# EAGLE design base_board4 (EAGLE 7.7.0)
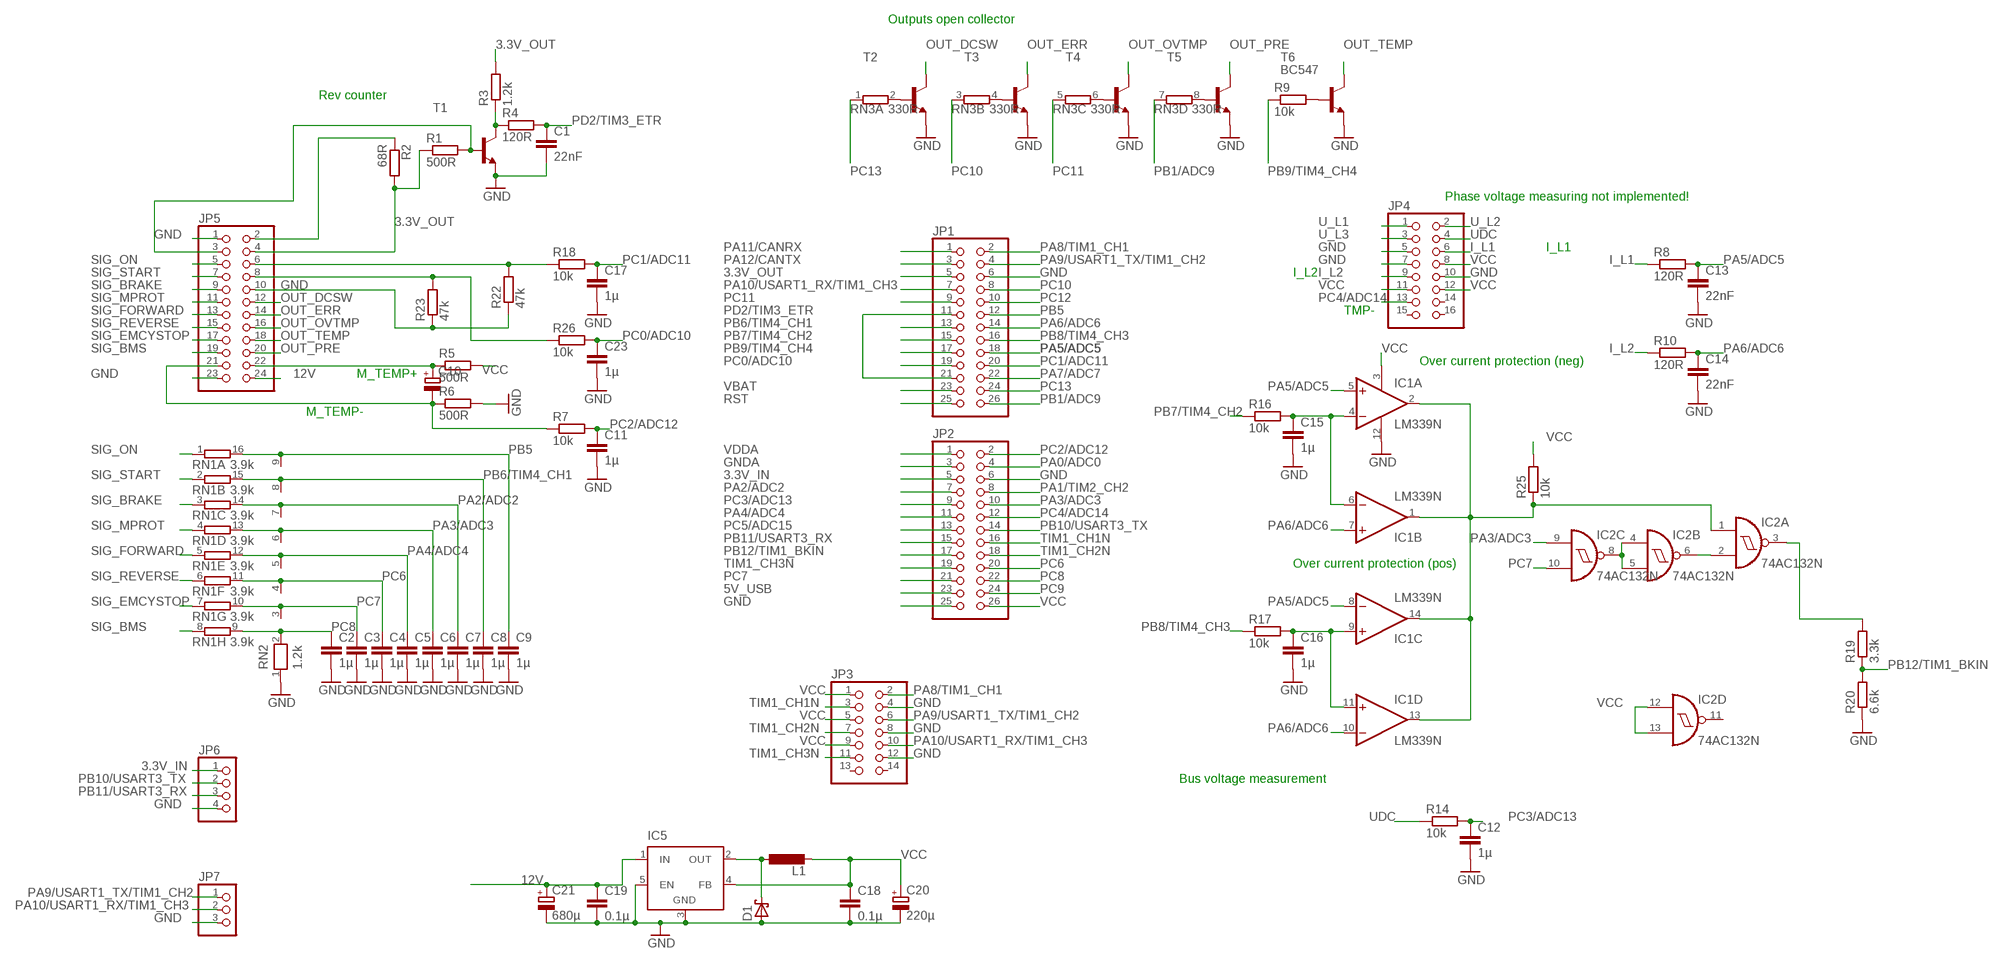
[diagram p0: schematic, sheet 1]

## Parts
C1  22nF  C-EU025-024X044  [C025-024X044]
C2  1µ  C-EU025-024X044  [C025-024X044]
C3  1µ  C-EU025-024X044  [C025-024X044]
C4  1µ  C-EU025-024X044  [C025-024X044]
C5  1µ  C-EU025-024X044  [C025-024X044]
C6  1µ  C-EU025-024X044  [C025-024X044]
C7  1µ  C-EU025-024X044  [C025-024X044]
C8  1µ  C-EU025-024X044  [C025-024X044]
C9  1µ  C-EU025-024X044  [C025-024X044]
C10  CPOL-EUE2-4  [E2-4]
C11  1µ  C-EU025-024X044  [C025-024X044]
C12  1µ  C-EU025-024X044  [C025-024X044]
C13  22nF  C-EU025-024X044  [C025-024X044]
C14  22nF  C-EU025-024X044  [C025-024X044]
C15  1µ  C-EU025-024X044  [C025-024X044]
C16  1µ  C-EU025-024X044  [C025-024X044]
C17  1µ  C-EU025-024X044  [C025-024X044]
C18  0.1µ  C-EU050-024X044  [C050-024X044]
C19  0.1µ  C-EU050-024X044  [C050-024X044]
C20  220µ  CPOL-EUE2-4  [E2-4]
C21  680µ  CPOL-EUE2.5-5  [E2,5-5]
C23  1µ  C-EU025-024X044  [C025-024X044]
D1  SCHOTTKY-DIODEDO201T15  [DO201T15]
IC1  LM339N  [DIL14]
IC2  74AC132N  [DIL14]
IC5  LM2596TV  [TO220-51]
JP1  PINHD-2X13  [2X13]
JP2  PINHD-2X13  [2X13]
JP3  PINHD-2X7  [2X07]
JP4  PINHD-2X8  [2X08]
JP5  PINHD-2X12  [2X12]
JP6  PINHD-1X4  [1X04]
JP7  PINHD-1X3  [1X03]
L1  L-EUTJ3-U1  [TJ3-U1]
R1  500R  R-EU_0207/10  [0207/10]
R2  68R  R-EU_0207/10  [0207/10]
R3  1.2k  R-EU_0207/10  [0207/10]
R4  120R  R-EU_0207/10  [0207/10]
R5  500R  R-EU_0207/10  [0207/10]
R6  500R  R-EU_0207/10  [0207/10]
R7  10k  R-EU_0207/10  [0207/10]
R8  120R  R-EU_0207/10  [0207/10]
R9  10k  R-EU_0207/10  [0207/10]
R10  120R  R-EU_0207/10  [0207/10]
R14  10k  R-EU_0207/10  [0207/10]
R16  10k  R-EU_0207/10  [0207/10]
R17  10k  R-EU_0207/10  [0207/10]
R18  10k  R-EU_0207/10  [0207/10]
R19  3.3k  R-EU_0207/10  [0207/10]
R20  6.6k  R-EU_0207/10  [0207/10]
R22  47k  R-EU_0207/10  [0207/10]
R23  47k  R-EU_0207/10  [0207/10]
R25  10k  R-EU_0207/10  [0207/10]
R26  10k  R-EU_0207/10  [0207/10]
RN1  3.9k  8R-N  [DIL16]
RN2  1.2k  RN08  [RN-9]
RN3  330R  E4R  [SIL8]
T1  BC547B-NPN-TO92-EBC  [TO92-EBC]
T2  -NPN-TO92-EBC  [TO92-EBC]
T3  -NPN-TO92-EBC  [TO92-EBC]
T4  -NPN-TO92-EBC  [TO92-EBC]
T5  -NPN-TO92-EBC  [TO92-EBC]
T6  BC547  [TO92]

## Nets
3.3V_IN: JP2.5 JP6.1
3.3V_OUT: JP1.5 JP5.4 R1.1 R2.2 R3.2
5V_USB: JP2.23
12V: C19.1 C21.+ IC5.1(IN) JP5.24
GND: C1.2 C2.2 C3.2 C4.2 C5.2 C6.2 C7.2 C8.2 C9.2 C11.2 C12.2 C13.2 C14.2 C15.2 C16.2 C17.2 C18.2 C19.2 C20.- C21.- C23.2 D1.A IC1.12(P:GND) IC5.3(GND) IC5.5(EN) JP1.6 JP2.6 JP2.25 JP3.4 JP3.8 JP3.12 JP4.5 JP4.7 JP4.10 JP5.1 JP5.10 JP5.23 JP6.4 JP7.3 R6.2 R20.1 R22.1 R23.1 RN2.1 T1.E T2.E T3.E T4.E T5.E T6.1(E)
GNDA: JP2.3
I_L1: JP4.6 R8.1
I_L2: JP4.9 R10.1
N2: R3.1 R4.1 T1.C
N$1: RN3.2 T2.B
N$2: RN3.4 T3.B
N$3: JP5.2 R2.1
N$4: RN3.6 T4.B
N$5: JP5.3 R1.2 T1.B
N$6: RN3.8 T5.B
N$7: R9.2 T6.2(B)
N$9: IC2.3(A:O) R19.2
N$10: C16.1 IC1.9(C:+IN) IC1.11(D:+IN) R17.2
N$12: IC2.2(A:I1) IC2.6(B:O)
N$13: C10.+ JP5.22 R5.1
N$14: D1.C IC5.2(OUT) L1.1
N$15: C15.1 IC1.4(A:-IN) IC1.6(B:-IN) R16.2
N$16: C10.- JP5.21 R6.1 R7.1
N$17: IC2.4(B:I0) IC2.5(B:I1) IC2.8(C:O)
N$21: IC1.1(B:OUT) IC1.2(A:OUT) IC1.13(D:OUT) IC1.14(C:OUT) IC2.1(A:I0) R25.1
OUT_DCSW: JP5.12 T2.C
OUT_ERR: JP5.14 T3.C
OUT_OVTMP: JP5.16 T4.C
OUT_PRE: JP5.20 T5.C
OUT_TEMP: JP5.18 T6.3(C)
PA0/ADC0: JP2.4
PA1/TIM2_CH2: JP2.8
PA2/ADC2: C7.1 JP2.7 RN1.14 RN2.7
PA3/ADC3: C6.1 IC2.9(C:I0) JP2.10 RN1.13 RN2.6
PA4/ADC4: C5.1 JP2.11 RN1.12 RN2.5
PA5/ADC5: C13.1 IC1.5(A:+IN) IC1.8(C:-IN) JP1.18 R8.2
PA6/ADC6: C14.1 IC1.7(B:+IN) IC1.10(D:-IN) JP1.14 R10.2
PA7/ADC7: JP1.22
PA8/TIM1_CH1: JP1.2 JP3.2
PA9/USART1_TX/TIM1_CH2: JP1.4 JP3.6 JP7.1
PA10/USART1_RX/TIM1_CH3: JP1.7 JP3.10 JP7.2
PA11/CANRX: JP1.1
PA12/CANTX: JP1.3
PB1/ADC9: JP1.26 RN3.7
PB5: C9.1 JP1.12 RN1.16 RN2.9
PB6/TIM4_CH1: C8.1 JP1.13 RN1.15 RN2.8
PB7/TIM4_CH2: JP1.15 R16.1
PB8/TIM4_CH3: JP1.16 R17.1
PB9/TIM4_CH4: JP1.17 R9.1
PB10/USART3_TX: JP2.14 JP6.2
PB11/USART3_RX: JP2.15 JP6.3
PB12/TIM1_BKIN: JP2.17 R19.1 R20.2
PC0/ADC10: C23.1 JP1.19 R26.2
PC1/ADC11: C17.1 JP1.20 R18.2
PC2/ADC12: C11.1 JP2.2 R7.2
PC3/ADC13: C12.1 JP2.9 R14.2
PC4/ADC14: JP2.12 JP4.13
PC5/ADC15: JP2.13
PC6: C4.1 JP2.20 RN1.11 RN2.4
PC7: C3.1 IC2.10(C:I1) JP2.21 RN1.10 RN2.3
PC8: C2.1 JP2.22 RN1.9 RN2.2
PC9: JP2.24
PC10: JP1.8 RN3.3
PC11: JP1.9 RN3.5
PC12: JP1.10
PC13: JP1.24 RN3.1
PD2/TIM3_ETR: C1.1 JP1.11 JP1.21 R4.2
RST: JP1.25
SIG_BMS: JP5.19 RN1.8
SIG_BRAKE: JP5.9 RN1.3
SIG_EMCYSTOP: JP5.17 RN1.7
SIG_FORWARD: JP5.13 RN1.5
SIG_MPROT: JP5.11 RN1.4
SIG_ON: JP5.5 RN1.1
SIG_REVERSE: JP5.15 RN1.6
SIG_START: JP5.7 RN1.2
TIM1_CH1N: JP2.16 JP3.3
TIM1_CH2N: JP2.18 JP3.7
TIM1_CH3N: JP2.19 JP3.11
U_L1: JP4.1
U_L2: JP4.2
U_L3: JP4.3
UDC: JP4.4 R14.1
VBAT: JP1.23
VCC: C18.1 C20.+ IC1.3(P:V+) IC2.12(D:I0) IC2.13(D:I1) IC5.4(FB) JP2.26 JP3.1 JP3.5 JP3.9 JP4.8 JP4.11 JP4.12 L1.2 R5.2 R25.2
VDDA: JP2.1
X: JP5.6 R18.1 R22.2
Y: JP5.8 R23.2 R26.1
Unconnected: IC2.11(D:O) JP3.13 JP3.14 JP4.14 JP4.15 JP4.16

## Notes on the sheet
- Outputs open collector
- Rev counter
- Phase voltage measuring not implemented!
- I_L1
- I_L2
- TMP-
- Over current protection (neg)
- M_TEMP+
- M_TEMP-
- Over current protection (pos)
- Bus voltage measurement

## Power pins joined to a net without a drawn wire
GND: IC2.7(P:GND)
VCC: IC2.14(P:VCC)

## Library data of the parts
C1-C9 C11-C19 C23 = rcl:C-EU: CAPACITOR, European symbol
C10 C20 C21 = rcl:CPOL-EU: POLARIZED CAPACITOR, European symbol
D1 = diode:SCHOTTKY-DIODE: Schottky Diode
IC1 = linear:LM339: Low Power Low Offset Voltage Quad Comparators with open collector; LM139/LM239/LM339/LM2901/LM3302
IC2 = 74xx-eu:74*132: Quad 2-input NAND schmitt trigger
IC5 = linear:LM2596T: STEP-DOWN VOLTAGE REGULATOR
JP1 JP2 = pinhead:PINHD-2X13: PIN HEADER
JP3 = pinhead:PINHD-2X7: PIN HEADER
JP4 = pinhead:PINHD-2X8: PIN HEADER
JP5 = pinhead:PINHD-2X12: PIN HEADER
JP6 = pinhead:PINHD-1X4: PIN HEADER
JP7 = pinhead:PINHD-1X3: PIN HEADER
L1 = rcl:L-EU: INDUCTOR, European symbol
R1-R10 R14 R16-R20 R22 R23 R25 R26 = rcl:R-EU_: RESISTOR, European symbol
RN1 = resistor-dil:8R-N: DIL RESISTOR
RN2 = resistor-net:RN08: RESISTOR NETWORK
RN3 = resistor-sil:E4R: SIL RESISTOR
T1 = transistor:*-NPN-: NPN Transistror BF959 corrected 2008.03.06
T2-T5 = transistor-neu-to92:*-NPN-: NPN Transistror BF959 corrected 2008.03.06
T6 = transistor:BC547: NPN TRANSISTOR

## Board
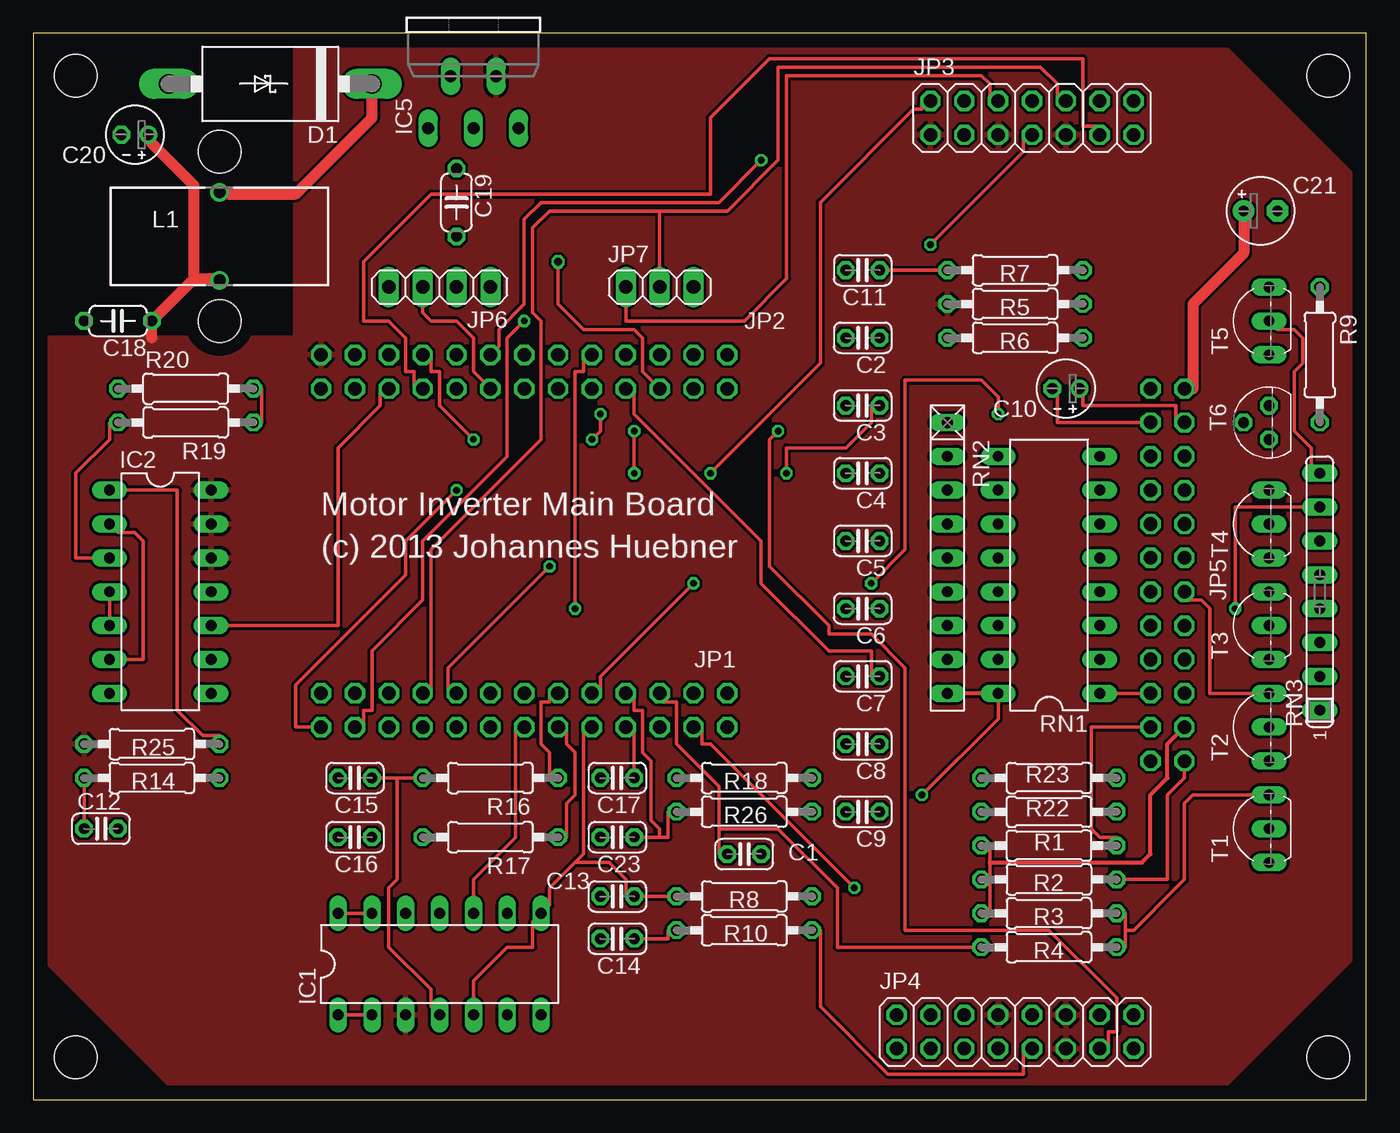
[diagram p1: board, top side]
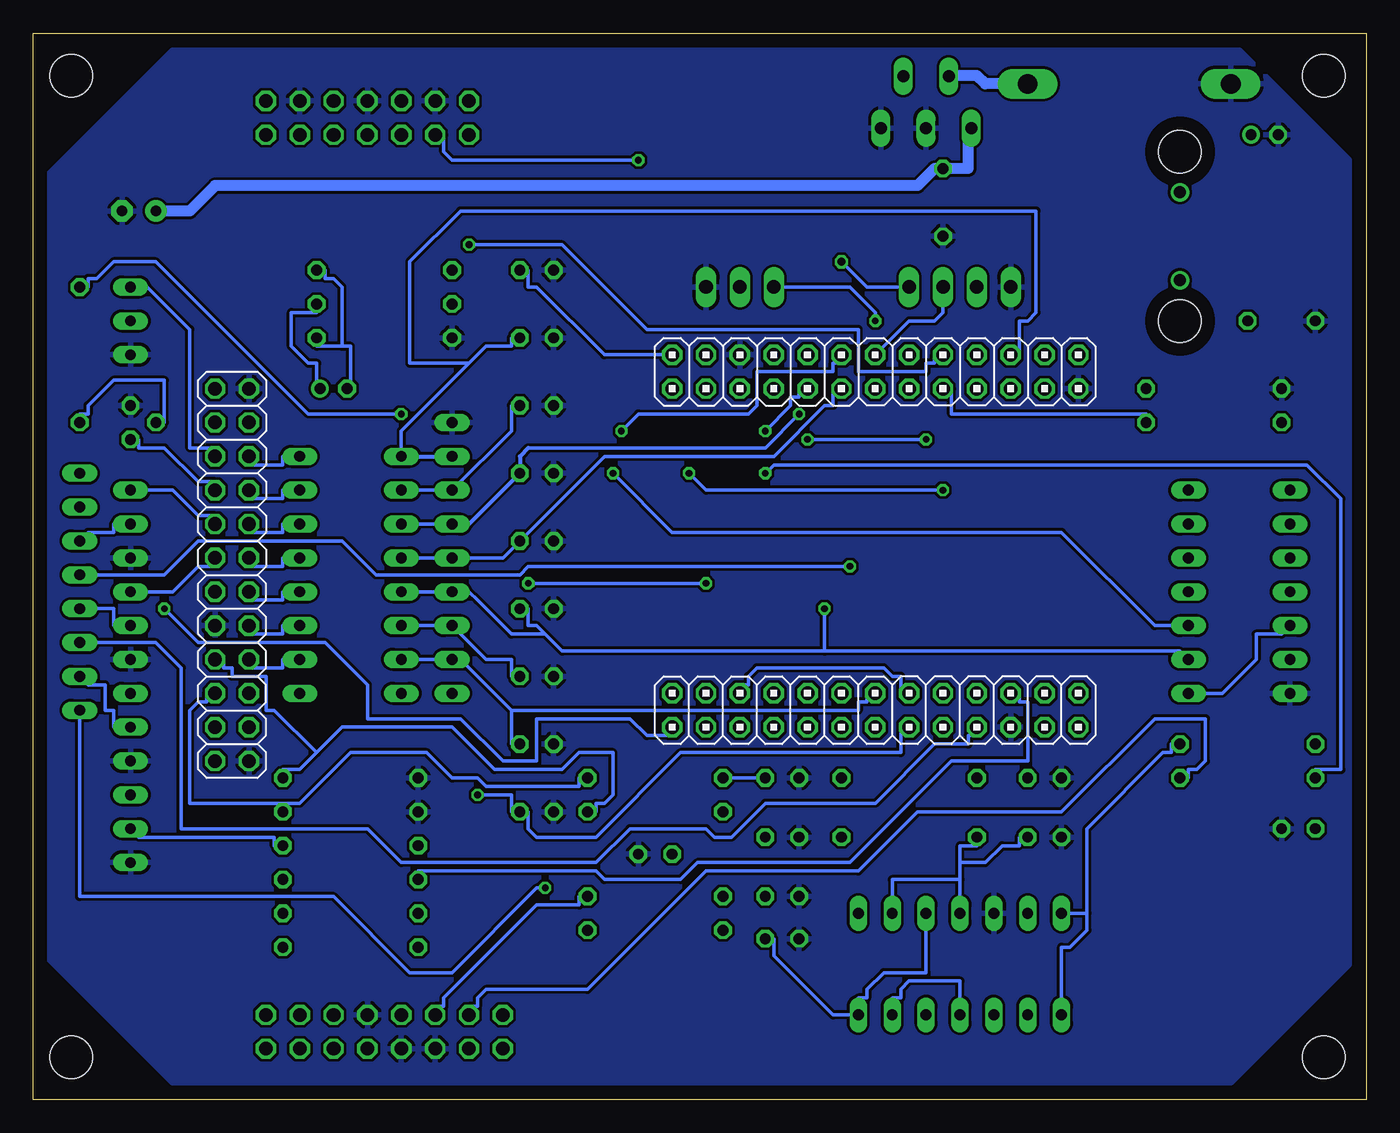
[diagram p2: board, bottom side, seen from below]

Size 100 x 80 mm. Coordinates in mm from the lower left corner, seen from the top.
Outline: 0,0 100,0 100,80 0,80 0,0
Copper layers (1*16): Top 0.035mm / dielectric 1.5mm / Bottom 0.035mm
Design rules "default *": minimum track width 10mil, minimum drill 20mil, track to track 8mil, track to pad 8mil, pad to pad 8mil, via to via 8mil, smd to smd 8mil, copper to edge 40mil, drill to drill 8mil, minimum pad ring 10mil, minimum via ring 8mil, stop-mask expansion 4mil, vias tented up to drill 0mil, thermal gap 10mil
Holes 3.2 mm at 3.17,76.83 3.17,3.17 97.16,3.17 97.16,76.83 13.97,71.12 13.97,58.42

### Footprints (pad centres in the part's own frame; a part is rotated, then mirrored left to right if it is on the bottom)
C025-024X044 = drill 0.813 octagon: 1 -1.27,0; 2 1.27,0
E2-4 = drill 0.813 pad 1.27: + -1.016,0 | drill 0.813 pad 1.27 octagon: - 1.016,0
C050-024X044 = drill 0.813 octagon: 1 -2.54,0; 2 2.54,0
E2,5-5 = drill 0.813 pad 1.6: + -1.27,0 | drill 0.813 pad 1.6 octagon: - 1.27,0
DO201T15 = drill 1.499 long: A 7.62,0; C -7.62,0
DIL14 = drill 0.813 long: 1 -7.62,-3.81; 2 -5.08,-3.81; 3 -2.54,-3.81; 4 0,-3.81; 5 2.54,-3.81; 6 5.08,-3.81; 7 7.62,-3.81; 8 7.62,3.81; 9 5.08,3.81; 10 2.54,3.81; 11 0,3.81; 12 -2.54,3.81; 13 -5.08,3.81; 14 -7.62,3.81
TO220-51 = drill 0.9 long: 1 -3.4,-8.4; 2 -1.7,-4.5; 3 0,-8.4; 4 1.7,-4.5; 5 3.4,-8.4
2X13 = drill 1.016 octagon: 1 -15.24,-1.27; 2 -15.24,1.27; 3 -12.7,-1.27; 4 -12.7,1.27; 5 -10.16,-1.27; 6 -10.16,1.27; 7 -7.62,-1.27; 8 -7.62,1.27; 9 -5.08,-1.27; 10 -5.08,1.27; 11 -2.54,-1.27; 12 -2.54,1.27; 13 0,-1.27; 14 0,1.27; 15 2.54,-1.27; 16 2.54,1.27; 17 5.08,-1.27; 18 5.08,1.27; 19 7.62,-1.27; 20 7.62,1.27; 21 10.16,-1.27; 22 10.16,1.27; 23 12.7,-1.27; 24 12.7,1.27; 25 15.24,-1.27; 26 15.24,1.27
2X07 = drill 1.016 octagon: 1 -7.62,-1.27; 2 -7.62,1.27; 3 -5.08,-1.27; 4 -5.08,1.27; 5 -2.54,-1.27; 6 -2.54,1.27; 7 0,-1.27; 8 0,1.27; 9 2.54,-1.27; 10 2.54,1.27; 11 5.08,-1.27; 12 5.08,1.27; 13 7.62,-1.27; 14 7.62,1.27
2X08 = drill 1.016 octagon: 1 -8.89,-1.27; 2 -8.89,1.27; 3 -6.35,-1.27; 4 -6.35,1.27; 5 -3.81,-1.27; 6 -3.81,1.27; 7 -1.27,-1.27; 8 -1.27,1.27; 9 1.27,-1.27; 10 1.27,1.27; 11 3.81,-1.27; 12 3.81,1.27; 13 6.35,-1.27; 14 6.35,1.27; 15 8.89,-1.27; 16 8.89,1.27
2X12 = drill 1.016 octagon: 1 -13.97,-1.27; 2 -13.97,1.27; 3 -11.43,-1.27; 4 -11.43,1.27; 5 -8.89,-1.27; 6 -8.89,1.27; 7 -6.35,-1.27; 8 -6.35,1.27; 9 -3.81,-1.27; 10 -3.81,1.27; 11 -1.27,-1.27; 12 -1.27,1.27; 13 1.27,-1.27; 14 1.27,1.27; 15 3.81,-1.27; 16 3.81,1.27; 17 6.35,-1.27; 18 6.35,1.27; 19 8.89,-1.27; 20 8.89,1.27; 21 11.43,-1.27; 22 11.43,1.27; 23 13.97,-1.27; 24 13.97,1.27
1X04 = drill 1.016 long: 1 -3.81,0; 2 -1.27,0; 3 1.27,0; 4 3.81,0
1X03 = drill 1.016 long: 1 -2.54,0; 2 0,0; 3 2.54,0
TJ3-U1 = drill 0.9: 1 -3.3,0; 2 3.3,0
0207/10 = drill 0.813 octagon: 1 -5.08,0; 2 5.08,0
DIL16 = drill 0.813 long: 1 -8.89,-3.81; 2 -6.35,-3.81; 3 -3.81,-3.81; 4 -1.27,-3.81; 5 1.27,-3.81; 6 3.81,-3.81; 7 6.35,-3.81; 8 8.89,-3.81; 9 8.89,3.81; 10 6.35,3.81; 11 3.81,3.81; 12 1.27,3.81; 13 -1.27,3.81; 14 -3.81,3.81; 15 -6.35,3.81; 16 -8.89,3.81
RN-9 = drill 0.813 long: 1 -10.16,0; 2 -7.62,0; 3 -5.08,0; 4 -2.54,0; 5 0,0; 6 2.54,0; 7 5.08,0; 8 7.62,0; 9 10.16,0
SIL8 = drill 0.813 long: 1 -8.89,0; 2 -6.35,0; 3 -3.81,0; 4 -1.27,0; 5 1.27,0; 6 3.81,0; 7 6.35,0; 8 8.89,0
TO92-EBC = drill 0.813 long: B 0,-1.27; C 2.54,-1.27; E -2.54,-1.27
TO92 = drill 0.813 octagon: 1 1.27,0; 2 0,1.905; 3 -1.27,0

### Placement (x,y rotation side)
C1  53.34,18.41 0 top
C2  62.23,57.15 180 top
C3  62.23,52.07 180 top
C4  62.23,46.99 180 top
C5  62.23,41.91 180 top
C6  62.23,36.83 180 top
C7  62.23,31.75 180 top
C8  62.23,26.67 180 top
C9  62.23,21.59 180 top
C10  77.47,53.34 180 top
C11  62.23,62.23 180 top
C12  5.08,20.32 0 top
C13  43.81,15.24 180 top
C14  43.81,12.06 180 top
C15  24.13,24.13 180 top
C16  24.13,19.68 180 top
C17  43.81,24.13 180 top
C18  6.35,58.42 180 top
C19  31.75,67.31 270 top
C20  7.62,72.39 180 top
C21  92.08,66.67 0 top
C23  43.81,19.68 180 top
D1  17.78,76.2 180 top
IC1  30.48,10.16 0 top
IC2  9.53,38.1 270 top
IC5  33.02,81.28 0 top
JP1  36.83,29.21 180 bottom
JP2  36.83,54.61 0 bottom
JP3  74.93,73.66 0 top
JP4  73.66,5.08 0 top
JP5  85.09,39.37 90 bottom
JP6  30.48,60.96 180 top
JP7  46.99,60.96 0 top
L1  13.97,64.77 270 top
R1  76.2,19.05 0 top
R2  76.2,16.51 180 top
R3  76.2,13.97 180 top
R4  76.2,11.43 180 top
R5  73.66,59.69 180 top
R6  73.66,57.15 180 top
R7  73.66,62.23 180 top
R8  53.34,15.24 180 top
R9  96.52,55.88 270 top
R10  53.34,12.7 180 top
R14  8.89,24.13 180 top
R16  34.29,24.13 180 top
R17  34.29,19.68 180 top
R18  53.34,24.13 180 top
R19  11.43,50.8 180 top
R20  11.43,53.34 0 top
R22  76.2,21.59 0 top
R23  76.2,24.13 0 top
R25  8.89,26.67 180 top
R26  53.34,21.59 180 top
RN1  76.2,39.37 90 top
RN2  68.58,40.64 270 top
RN3  96.52,38.1 90 top
T1  91.44,20.32 90 top
T2  91.44,27.94 90 top
T3  91.44,35.56 90 top
T4  91.44,43.18 90 top
T5  91.44,58.42 90 top
T6  92.71,50.8 90 top

### Tracks (layer width: path | path; a pad name or v marks a point on that pad's centre or on a via)
3.3V_IN  (via drill 0.6)
  Top 0.254: JP2.5 45.72,54.61 45.72,57.15 45.09,57.78 41.27,57.78 39.37,59.69 v39.37,62.87
  Bottom 0.254: v39.37,62.87 37.47,60.96 JP6.1
3.3V_OUT
  Top 0.254: 71.75,16.51 71.75,13.97 R3.2 | 71.75,16.51 71.75,17.78 71.75,19.05 R1.1 | R2.2 71.75,16.51
  Top 0.305: JP5.4 85.09,26.67 85.09,24.13 83.82,22.86 83.82,18.41 83.19,17.78 71.75,17.78
  Bottom 0.254: JP1.5 26.04,30.48 26.04,29.84 25.4,29.84 25.4,25.4 31.11,25.4 38.73,17.78 50.16,17.78 51.44,16.51 57.15,16.51 57.78,17.14 71.12,17.14 R2.2
12V
  Top 0.254: 87,53.34 JP5.24
  Top 0.813: 87,53.34 87,59.69 90.81,63.5 C21.+
  Bottom 0.254: 29.84,73.03 IC5.1 | C19.1 32.38,69.85
  Bottom 0.813: 29.84,73.03 29.84,69.85 C19.1 | 32.38,69.85 33.66,68.58 86.36,68.58 88.27,66.67 C21.+
GND
  pour Bottom: 1.27,70.48 9.53,78.74 88.27,78.74 89.53,78.74 99.06,69.22 99.06,10.79 89.53,1.27 10.16,1.27 1.27,10.16
I_L1
  Bottom 0.254: R8.1 59.05,15.24 59.05,14.61 62.23,14.61 69.22,7.62 69.22,6.99 69.85,6.99 JP4.6
I_L2
  Top 0.254: R10.1 59.05,12.7 59.05,6.99 64.14,1.91 74.3,1.91 74.3,3.81 JP4.9
N2
  Top 0.254: 81.92,12.7 81.92,13.97 R3.1 | 81.92,12.7 81.92,11.43 R4.1 | 81.92,12.7 82.55,12.7 85.72,15.88 86.36,16.51 86.36,22.23 87,22.86 T1.C
N$1
  Bottom 0.254: T2.B 93.98,27.94 93.98,29.21 94.61,29.21 94.61,31.11 95.89,31.11 RN3.2
N$2
  Bottom 0.254: T3.B 93.98,35.56 93.98,36.83 RN3.4
N$3
  Top 0.254: JP5.2 86.36,24.13 85.09,22.86 85.09,16.51 R2.1
N$4
  Bottom 0.254: T4.B 93.98,43.18 93.98,42.55 95.89,42.55 RN3.6
N$5
  Top 0.254: JP5.3 79.38,27.94 79.38,20.32 80.01,19.68 81.28,19.68 R1.2
  Bottom 0.254: R1.2 81.92,19.05 81.92,19.68 92.08,19.68 T1.B
N$6
  Top 0.254: RN3.8 95.89,47.62 95.89,48.9 94.61,50.16 94.61,54.61 95.25,55.24 95.25,57.15 94.61,57.78 93.34,57.78 T5.B
N$7
  Bottom 0.254: T6.2 90.17,50.8 90.17,53.98 93.98,53.98 95.89,52.07 95.89,51.44 96.52,51.44 R9.2
N$9
  Top 0.254: IC2.3 3.17,40.64 3.17,46.99 5.71,49.53 5.71,50.8 R19.2
N$10
  Bottom 0.254: 30.48,17.78 30.48,19.05 29.21,19.05 R17.2 | 30.48,16.51 30.48,17.78 | IC1.11 30.48,16.51 | 30.48,16.51 35.56,16.51 IC1.9 | 30.48,17.78 28.57,17.78 27.3,19.05 26.04,19.05 26.04,19.68 C16.1
N$12
  Top 0.254: IC2.6 8.26,33.02 8.26,41.91 7.62,42.55 6.35,42.55 IC2.2
N$13
  Top 0.254: JP5.22 85.72,50.8 85.72,52.07 78.74,52.07 78.74,52.7 C10.+
  Bottom 0.254: C10.+ 78.74,53.98 78.74,55.24 79.38,55.24 80.64,56.52 80.64,59.05 78.74,59.05 R5.1
N$14
  Top 0.254: L1.1 14.61,67.94
  Top 0.813: 14.61,67.94 19.68,67.94 25.4,73.66 D1.C
  Bottom 0.254: 31.11,76.83 IC5.2
  Bottom 0.813: 31.11,76.83 29.21,76.83 28.57,76.2 D1.C
N$15
  Top 0.254: 27.3,24.13 C15.1 | 27.3,24.13 R16.2 | 27.3,24.13 27.3,16.51 26.67,15.88 26.67,11.43 29.84,8.26 29.84,6.99 IC1.4
  Bottom 0.254: IC1.4 30.48,8.89 34.29,8.89 34.92,8.26 34.92,7.62 35.56,7.62 IC1.6
N$16
  Top 0.254: JP5.21 76.83,50.8 76.83,53.34 C10.-
  Bottom 0.254: 76.83,56.52 78.74,56.52 R6.1 | 76.83,56.52 76.2,56.52 76.2,53.98 C10.- | 76.83,56.52 76.83,60.96 77.47,61.59 78.11,61.59 78.11,62.23 R7.1
N$17
  Top 0.254: IC2.5 IC2.4
  Bottom 0.254: IC2.8 10.79,30.48 8.26,33.02 8.26,34.92 6.35,34.92 IC2.5
N$21
  Top 0.254: IC1.1 IC1.2 | IC1.14 IC1.13 | IC2.1 10.79,45.72 10.79,29.21 12.7,27.3 13.97,27.3 R25.1
  Bottom 0.254: 20.95,13.97 20.95,20.32 15.24,26.04 14.61,26.04 14.61,26.67 R25.1 | 20.95,13.97 IC1.14 | 20.95,13.97 20.95,12.7 22.23,11.43 22.86,11.43 IC1.1
OUT_DCSW
  Top 0.254: T2.C 88.27,30.48 88.27,36.83 87.63,37.47 86.36,37.47 JP5.12
OUT_ERR
  Bottom 0.254: T3.C 89.53,38.1 87.63,40.01 86.36,40.01 JP5.14
OUT_OVTMP
  Bottom 0.254: T4.C 89.53,45.72 87.63,43.81 86.36,43.81 JP5.16
OUT_PRE
  Bottom 0.254: T5.C 91.44,60.96 88.27,57.78 88.27,48.9 86.36,48.9 JP5.20
OUT_TEMP
  Bottom 0.254: T6.3 92.08,49.53 92.08,48.9 90.17,48.9 87.63,46.35 86.36,46.35 JP5.18
PA2/ADC2
  Top 0.254: JP2.7 45.09,53.34 45.09,51.44 54.61,41.91 54.61,38.73 59.69,33.66 62.87,33.66 62.87,31.75 C7.1
  Bottom 0.254: C7.1 64.14,31.75 64.14,33.02 66.04,33.02 RN2.7 RN1.14
PA3/ADC3  (via drill 0.51)
  Top 0.254: v40.64,36.83 40.64,54.61 41.27,54.61 41.27,55.88 JP2.10
  Bottom 0.254: 40.64,33.66 60.33,33.66 61.59,34.92 | 61.59,34.92 62.23,35.56 62.87,35.56 62.87,36.83 C6.1 | IC2.9 13.97,33.66 40.64,33.66 | 61.59,34.92 64.14,34.92 66.67,37.47 67.31,38.1 RN2.6 RN1.13 | 40.64,33.66 v40.64,36.83
PA4/ADC4
  Bottom 0.254: RN1.12 RN2.5 64.77,40.64 C5.1 57.15,48.26 44.45,48.26 40.64,52.07 40.01,52.07 40.01,53.34 JP2.11
PA5/ADC5
  Top 0.254: R8.2 C13.1 44.45,15.24 44.45,16.51 43.18,17.78 40.64,17.78 | IC1.5 33.02,8.89 35.56,11.43 37.47,11.43 37.47,13.34 IC1.8 38.73,14.61 38.73,15.88 40.64,17.78 | 40.64,17.78 41.27,18.41 41.27,27.94 JP1.18
PA6/ADC6
  Top 0.254: C14.1 47.62,12.06 47.62,12.7 R10.2 | JP1.14 36.2,27.94 36.2,19.68 33.02,16.51 IC1.10
  Bottom 0.254: IC1.10 33.02,9.53 36.2,9.53 37.47,8.26 37.47,7.62 38.1,7.62 IC1.7 40.01,6.35 44.45,10.79 44.45,12.06 C14.1
PA8/TIM1_CH1  (via drill 0.51)
  Top 0.254: v31.75,45.72 27.94,41.91 27.94,39.37 19.68,31.11 19.68,27.94 JP1.2 | v50.8,46.99 59.05,55.24 59.05,67.31 66.04,74.3 66.67,74.3 66.67,74.93 JP3.2
  Bottom 0.254: v31.75,45.72 49.53,45.72 v50.8,46.99
PA9/USART1_TX/TIM1_CH2  (via drill 0.51)
  Top 0.254: v36.83,58.42 35.56,57.15 35.56,48.26 29.21,41.91 29.21,37.47 25.4,33.66 25.4,29.21 24.77,29.21 24.77,27.94 JP1.4 | JP3.6 71.75,74.93 71.75,76.2 71.12,76.83 56.52,76.83 56.52,61.59 53.34,58.42 46.99,58.42 44.45,58.42 JP7.1
  Bottom 0.254: JP7.1 38.73,60.96 36.83,59.05 v36.83,58.42
PA10/USART1_RX/TIM1_CH3
  Top 0.254: 46.99,66.67 38.73,66.67 37.47,65.41 37.47,59.05 38.1,58.42 38.1,49.53 29.84,41.27 29.84,30.48 JP1.7 | 46.99,66.67 52.07,66.67 55.88,70.48 55.88,77.47 75.56,77.47 76.83,76.2 76.83,74.93 JP3.10 | 46.99,66.67 JP7.2
PB1/ADC9  (via drill 0.51)
  Top 0.254: v90.17,36.83 90.17,44.45 RN3.7
  Bottom 0.254: v90.17,36.83 87.63,34.29 78.11,34.29 74.93,31.11 74.93,28.57 67.94,28.57 64.77,25.4 62.23,25.4 62.23,28.57 55.24,28.57 53.98,27.3 52.07,27.3 JP1.26
PB5  (via drill 0.51)
  Top 0.254: v66.67,22.86 72.39,28.57 RN1.16
  Top 0.305: RN1.16 RN2.9
  Bottom 0.254: v66.67,22.86 64.14,22.86 64.14,21.59 C9.1 62.87,21.59 62.87,20.32 62.23,19.68 57.78,19.68 51.44,26.04 34.92,26.04 34.92,27.94 JP1.12
PB6/TIM4_CH1
  Bottom 0.254: 64.14,29.21 64.14,26.67 C8.1 | 64.14,29.21 67.94,33.02 RN2.8 RN1.15 | 64.14,29.21 38.1,29.21 38.1,29.84 37.47,29.84 37.47,30.48 JP1.13
PB7/TIM4_CH2
  Top 0.254: R16.1 38.73,24.13 38.73,26.04 38.1,26.67 38.1,29.84 38.73,29.84 38.73,30.48 JP1.15
PB8/TIM4_CH3
  Top 0.254: R17.1 40.01,19.68 40.01,22.23 40.64,22.86 40.64,26.04 40.01,26.67 40.01,27.94 JP1.16
PB9/TIM4_CH4  (via drill 0.51)
  Top 0.254: v72.39,51.44 72.39,52.7 71.12,53.98 65.41,53.98 65.41,41.27 v62.87,38.73 | v49.53,38.73 42.55,31.75 42.55,30.48 JP1.17
  Bottom 0.254: v72.39,51.44 79.38,51.44 90.81,62.87 93.98,62.87 95.25,61.59 95.89,61.59 95.89,60.96 R9.1 | v49.53,38.73 v62.87,38.73
PB10/USART3_TX
  Bottom 0.254: JP2.14 34.29,58.42 32.38,58.42 31.75,59.05 JP6.2
PB11/USART3_RX
  Top 0.254: JP2.15 33.02,54.61 33.02,57.15 31.75,58.42 29.84,58.42 29.21,59.05 JP6.3
PB12/TIM1_BKIN
  Top 0.254: R19.1 17.14,50.8 17.14,53.34 R20.2
  Bottom 0.254: JP2.17 31.11,53.34 31.11,51.44 16.51,51.44 R19.1
PC0/ADC10
  Top 0.254: 46.99,19.68 47.62,19.68 47.62,21.59 R26.2 | C23.1 46.99,19.68 | 46.99,19.68 46.99,20.32 46.35,20.95 46.35,25.4 45.72,26.04 45.72,29.21 45.09,29.21 45.09,30.48 JP1.19
PC1/ADC11
  Top 0.254: C17.1 45.09,27.94 JP1.20
  Bottom 0.254: C17.1 R18.2
PC2/ADC12
  Top 0.254: C11.1 R7.2
  Bottom 0.254: 52.7,55.88 JP2.2 57.15,55.88 62.23,60.96 62.87,60.96 62.87,62.23 C11.1
PC3/ADC13  (via drill 0.51)
  Top 0.254: C12.1 R14.2 | v45.09,46.99 v45.09,50.16
  Bottom 0.254: v45.09,50.16 43.18,52.07 43.18,52.7 42.55,52.7 42.55,53.34 JP2.9 | v45.09,46.99 44.45,47.62 4.45,47.62 1.91,45.09 1.91,24.77 3.81,24.77 R14.2
PC4/ADC14  (via drill 0.51)
  Top 0.254: v55.88,50.16 55.24,49.53 55.24,40.01 59.69,35.56 59.69,34.92 62.87,34.92 65.41,32.38 65.41,12.7 76.2,12.7 81.28,7.62 81.28,5.08 80.64,5.08 80.64,3.81 JP4.13
  Bottom 0.254: v55.88,50.16 54.61,51.44 46.35,51.44 45.72,52.07 45.72,54.61 40.01,54.61 40.01,55.24 39.37,55.24 JP2.12
PC6  (via drill 0.51)
  Top 0.254: v33.02,49.53 30.48,52.07 30.48,54.61 29.84,54.61 29.84,55.88 JP2.20 | v41.91,49.53 42.55,50.16 v42.55,51.44
  Bottom 0.254: RN2.4 RN1.11 | v33.02,49.53 v41.91,49.53 | v42.55,51.44 45.09,48.9 62.87,48.9
  Bottom 0.305: RN2.4 67.31,43.18 C4.1 63.5,48.26 62.87,48.9
PC7  (via drill 0.51)
  Top 0.254: IC2.10 22.86,35.56 22.86,48.9 26.04,52.07 26.04,53.34 JP2.21 | v56.52,46.99 56.52,48.9 60.96,48.9 62.87,50.8 62.87,52.07 C3.1
  Bottom 0.254: C3.1 64.14,52.07 64.14,50.16 RN2.3 RN1.10 | v56.52,46.99 52.07,42.55 22.86,42.55 15.88,35.56 IC2.10
PC8
  Bottom 0.254: 67.31,55.24 72.39,50.16 RN1.9 | 67.31,55.24 66.04,56.52 64.14,56.52 64.14,57.15 C2.1 | 67.31,55.24 71.75,55.24 71.75,62.87 67.94,66.67 24.77,66.67 24.77,59.05 25.4,58.42 26.04,58.42 26.04,55.88 JP2.22
  Bottom 0.305: RN1.9 RN2.2
PC10
  Bottom 0.254: RN3.3 90.81,34.29 88.9,32.38 88.9,20.32 74.93,20.32 72.39,17.78 57.78,17.78 55.24,20.32 49.53,20.32 48.9,19.68 47.62,19.68 45.09,22.23 36.83,22.23 32.38,26.67 29.84,26.67 29.84,27.3 29.21,27.3 JP1.8
PC11  (via drill 0.51)
  Top 0.254: v38.73,40.01 31.11,32.38 31.11,30.48 JP1.9
  Bottom 0.254: v38.73,40.01 62.87,40.01 63.5,39.37 74.3,39.37 76.83,41.91 87.63,41.91 90.17,39.37 RN3.5
PC13  (via drill 0.51)
  Top 0.254: v61.59,15.88 50.8,26.67 50.16,26.67 50.16,27.94 JP1.24
  Bottom 0.254: v61.59,15.88 62.23,15.88 68.58,9.53 71.75,9.53 77.47,15.24 96.52,15.24 RN3.1
PD2/TIM3_ETR
  Top 0.254: 51.44,20.32 51.44,23.5 48.26,26.67 48.26,29.84 46.99,29.84 JP1.21 | 51.44,20.32 51.44,18.41 C1.1 | 51.44,20.32 55.88,20.32 60.33,15.88 60.33,11.43 R4.2
  Bottom 0.254: JP1.11 34.92,30.48 34.92,31.75 35.56,31.75 36.2,32.38 45.72,32.38 46.35,31.75 46.35,31.11 46.99,31.11 JP1.21
SIG_BMS
  Bottom 0.254: RN1.8 81.28,48.26 81.28,47.62 83.82,47.62 JP5.19
SIG_BRAKE
  Bottom 0.254: RN1.3 81.28,35.56 81.28,34.92 83.82,34.92 JP5.9
SIG_EMCYSTOP
  Bottom 0.254: RN1.7 81.28,45.72 81.28,45.09 83.82,45.09 JP5.17
SIG_FORWARD
  Bottom 0.254: RN1.5 81.28,40.64 81.28,40.01 83.82,40.01 JP5.13
SIG_MPROT
  Bottom 0.254: RN1.4 81.28,38.1 81.28,37.47 83.82,37.47 JP5.11
SIG_ON
  Top 0.254: RN1.1 JP5.5
SIG_REVERSE
  Bottom 0.254: RN1.6 81.28,43.18 81.28,42.55 83.82,42.55 JP5.15
SIG_START
  Bottom 0.254: RN1.2 81.28,33.02 81.28,32.38 83.82,32.38 JP5.7
TIM1_CH1N  (via drill 0.51)
  Top 0.254: v54.61,70.48 51.44,67.31 38.1,67.31 36.83,66.04 36.83,59.69 34.92,57.78 34.92,56.52 JP2.16
  Bottom 0.254: v54.61,70.48 68.58,70.48 69.22,71.12 69.22,72.39 JP3.3
TIM1_CH2N  (via drill 0.51)
  Top 0.254: v67.31,64.14 74.3,71.12 74.3,72.39 JP3.7
  Bottom 0.254: v67.31,64.14 60.33,64.14 53.98,57.78 38.1,57.78 38.1,54.61 33.02,54.61 33.02,55.24 32.38,55.24 32.38,55.88 JP2.18
TIM1_CH3N
  Top 0.254: JP2.19 28.57,53.34 28.57,54.61 27.94,54.61 27.94,57.15 26.67,58.42 24.77,58.42 24.77,62.87 29.84,67.94 50.8,67.94 50.8,73.66 55.24,78.11 78.74,78.11 78.74,73.03 80.01,73.03 JP3.11
UDC
  Bottom 0.254: R14.1 13.34,24.13 13.34,24.77 12.7,24.77 12.06,25.4 12.06,28.57 15.88,28.57 22.86,21.59 33.66,21.59 38.1,17.14 49.53,17.14 58.42,8.26 66.04,8.26 66.67,7.62 66.67,6.99 67.31,6.99 JP4.4
VCC
  Top 0.254: 13.34,61.59 L1.2
  Top 0.813: 8.89,57.15 C18.1 12.06,61.59 | 12.06,61.59 13.34,61.59 | 12.06,61.59 12.06,68.58 8.89,71.75 C20.+
  pour Top: 1.27,57.15 19.68,57.15 19.68,78.74 89.53,78.74 99.06,69.22 99.06,10.79 89.53,1.27 10.16,1.27 1.27,10.16
X
  Bottom 0.254: 81.28,22.23 80.01,22.23 76.2,26.04 70.48,26.04 68.58,24.13 66.67,24.13 66.04,23.5 59.05,23.5 59.05,24.13 R18.1 | 81.28,22.23 88.27,22.23 88.27,29.21 87.63,29.84 87,29.84 87,30.48 JP5.6 | 81.28,22.23 R22.2
Y
  Bottom 0.254: 78.74,26.04 80.01,24.77 81.28,24.77 R23.2 | 78.74,26.04 76.83,27.94 68.58,27.94 65.41,24.77 60.33,24.77 59.05,26.04 56.52,26.04 56.52,22.86 57.15,22.23 57.78,22.23 57.78,21.59 R26.1 | 78.74,26.04 81.92,29.21 82.55,29.21 82.55,31.75 85.09,31.75 85.09,32.38 85.72,32.38 85.72,33.02 JP5.8

### Text on the board
tNames: Motor Inverter Main Board | (c) 2013 Johannes Huebner